# EAGLE design servoDrv (EAGLE 6.4)
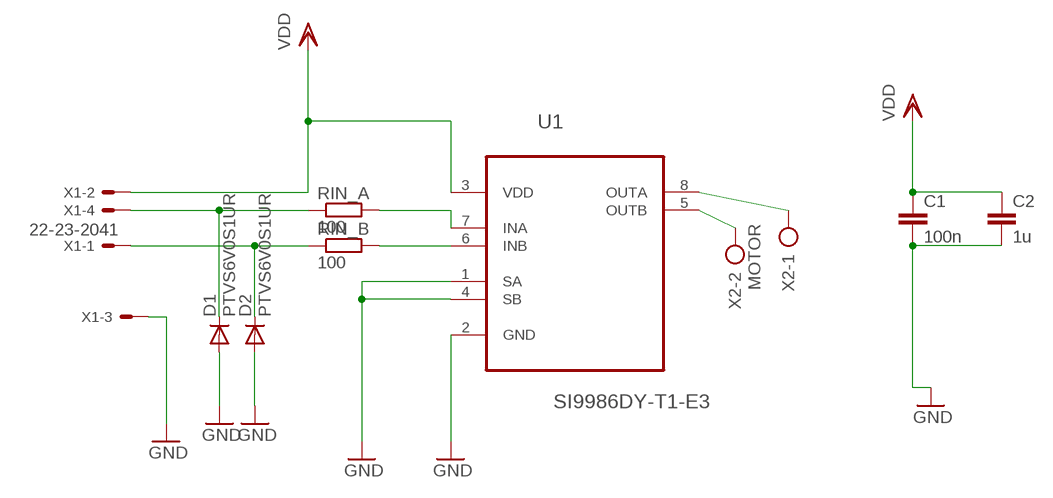
[diagram p0: schematic, sheet 1]

## Parts
C1  100n  C-EUC0805  [C0805]
C2  1u  C-EUC0805  [C0805]
D1  PTVS6V0S1UR  DIODE-SOD123  [SOD123]
D2  PTVS6V0S1UR  DIODE-SOD123  [SOD123]
RIN_A  100  R-EU_0207/10  [0207/10]
RIN_B  100  R-EU_0207/10  [0207/10]
U1  SI9986DY-T1-E3  [SOIC127P600X175-8N]
X1  22-23-2041  [22-23-2041]
X2  MOTOR  AK500/2  [AK500/2]

## Nets
GND: C1.2 C2.2 D1.A D2.A U1.1(SA) U1.2(GND) U1.4(SB) X1.3
N$1: U1.8(OUTA) X2.1
N$2: U1.5(OUTB) X2.2
N$5: D1.C RIN_A.1 X1.4
N$6: RIN_A.2 U1.7(INA)
N$7: RIN_B.2 U1.6(INB)
N$8: D2.C RIN_B.1 X1.1
VDD: C1.1 C2.1 U1.3(VDD) X1.2

## Library data of the parts
C1 C2 = resistor:C-EU: CAPACITOR, European symbol
D1 D2 = diode:DIODE-: DIODE
RIN_A RIN_B = resistor2:R-EU_: RESISTOR, European symbol
U1 = vishay_motor:SI9986DY-T1-E3: Buffered H-Bridge; MPN: SI9986DY-T1-E3; OC_FARNELL: 1469440; OC_NEWARK: 06J8287; PACKAGE: SOIC-8; SUPPLIER: VISHAY SILICONIX
X1 = con-molex:22-23-2041: .100" (2.54mm) Center Header - 4 Pin; MF: MOLEX; MPN: 22-23-2041; OC_FARNELL: 1462920; OC_NEWARK: 38C0355
X2 = con-ptr500:AK500/2: CONNECTOR; OC_FARNELL: unknown; OC_NEWARK: unknown

## Board
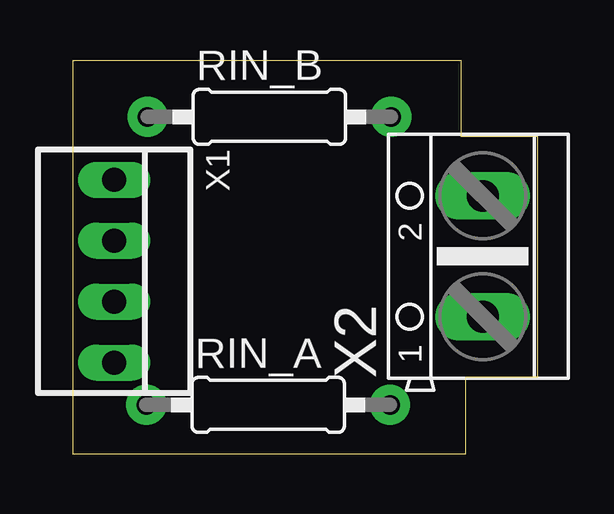
[diagram p1: board, top side]
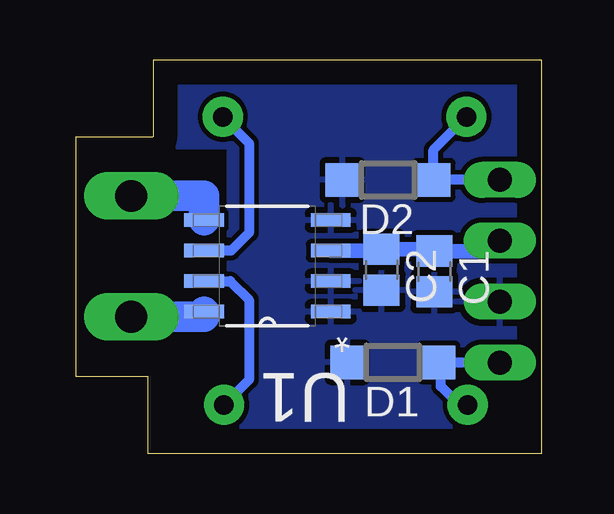
[diagram p2: board, bottom side, seen from below]

Size 19.4 x 16.4 mm. Coordinates in mm from the lower left corner, seen from the top.
Outline: 0,0 16.4,0 16.4,3.2 19.4,3.2 19.4,13.2 16.2,13.2 16.2,16.4 0,16.4 0,0
Copper layers (1*16): Top 0.035mm / dielectric 1.5mm / Bottom 0.035mm
Design rules "default *": minimum track width 10mil, minimum drill 24mil, track to track 8mil, track to pad 8mil, pad to pad 8mil, via to via 8mil, smd to smd 8mil, copper to edge 40mil, drill to drill 8mil, minimum pad ring 10mil, minimum via ring 8mil, stop-mask expansion 4mil, vias tented up to drill 0mil, thermal gap 10mil

### Footprints (pad centres in the part's own frame; a part is rotated, then mirrored left to right if it is on the bottom)
C0805 = smd 1.3 x 1.5: 1 -0.85,0; 2 0.85,0
SOD123 = smd 1.4 x 1.4: A 1.9,0; C -1.9,0
0207/10 = drill 0.813 pad 1.676: 1 -5.08,0; 2 5.08,0
SOIC127P600X175-8N = smd 1.651 x 0.559: 1 -2.642,1.905; 2 -2.642,0.635; 3 -2.642,-0.635; 4 -2.642,-1.905; 5 2.642,-1.905; 6 2.642,-0.635; 7 2.642,0.635; 8 2.642,1.905
22-23-2041 = drill 1 long: 1 -3.81,0; 2 -1.27,0; 3 1.27,0; 4 3.81,0
AK500/2 = drill 1.321 long: 1 -2.515,0; 2 2.515,0

### Placement (x,y rotation side)
C1  4.47,7.59 270 bottom
C2  6.67,7.66 270 bottom
D1  6.2,3.8 180 bottom
D2  6.4,11.4 180 bottom
RIN_A  8.16,2.03 0 top
RIN_B  8.21,14.03 0 top
U1  11.43,7.82 180 bottom
X1  1.74,7.6 270 top
X2  17.11,8.22 90 top

### Tracks (layer width: path | path; a pad name or v marks a point on that pad's centre or on a via)
GND
  pour Bottom: 0,16.4 16.2,16.4 16.2,12.8 13,12.8 13,3.2 16.4,3.2 16.4,3 16.4,0 0,0
N$1
  Bottom 1.27: U1.8 14.07,5.71 X2.1
N$2
  Bottom 1.27: U1.5 14.07,10.73 X2.2
N$5
  Bottom 0.406: X1.4 D1.C 4.2,3.7 4.2,2.8 3.43,2.03 RIN_A.1
N$6
  Bottom 0.406: U1.7 12.98,7.18 12.2,6.4 12.2,3.07 RIN_A.2
N$7
  Bottom 0.406: RIN_B.2 12.2,12.94 12.2,9.2 12.95,8.46 U1.6
N$8
  Bottom 0.406: X1.1 D2.C 4.5,12.66 RIN_B.1
VDD
  Bottom 0.61: X1.2 1.74,8.44 C1.1 4.47,8.51 C2.1 6.67,8.46 U1.3